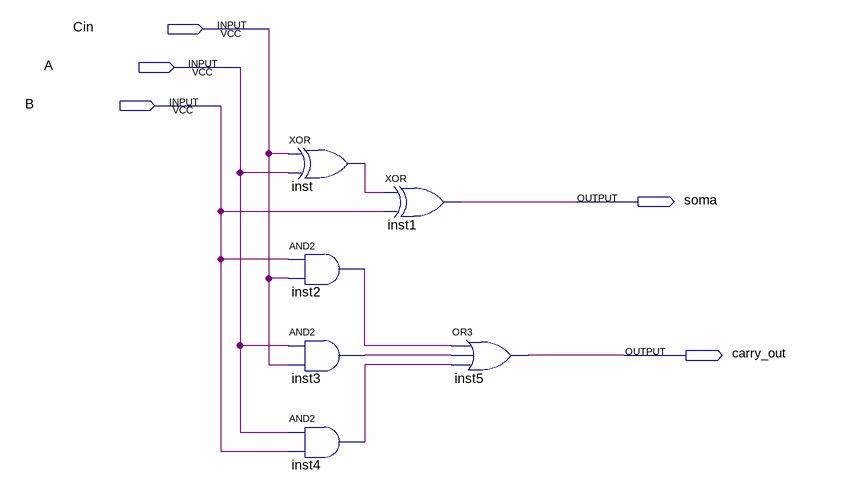
[diagram p0: schematic sheet]
// Quartus schematic somador_completo.bdf as structural Verilog: 6 symbols, 5 pins
module somador_completo (
  input  Cin,
  input  A,
  input  B,
  output soma,
  output carry_out
);

  wire inst2_out, inst3_out, inst4_out, inst_out;

  xor inst (inst_out, Cin, A);
  and inst2 (inst2_out, B, Cin);
  and inst3 (inst3_out, A, Cin);
  and inst4 (inst4_out, A, B);
  xor inst1 (soma, inst_out, B);
  or inst5 (carry_out, inst2_out, inst3_out, inst4_out);
endmodule
